# Altium schematic sheet Z7_DDR3.SchDoc
size A3
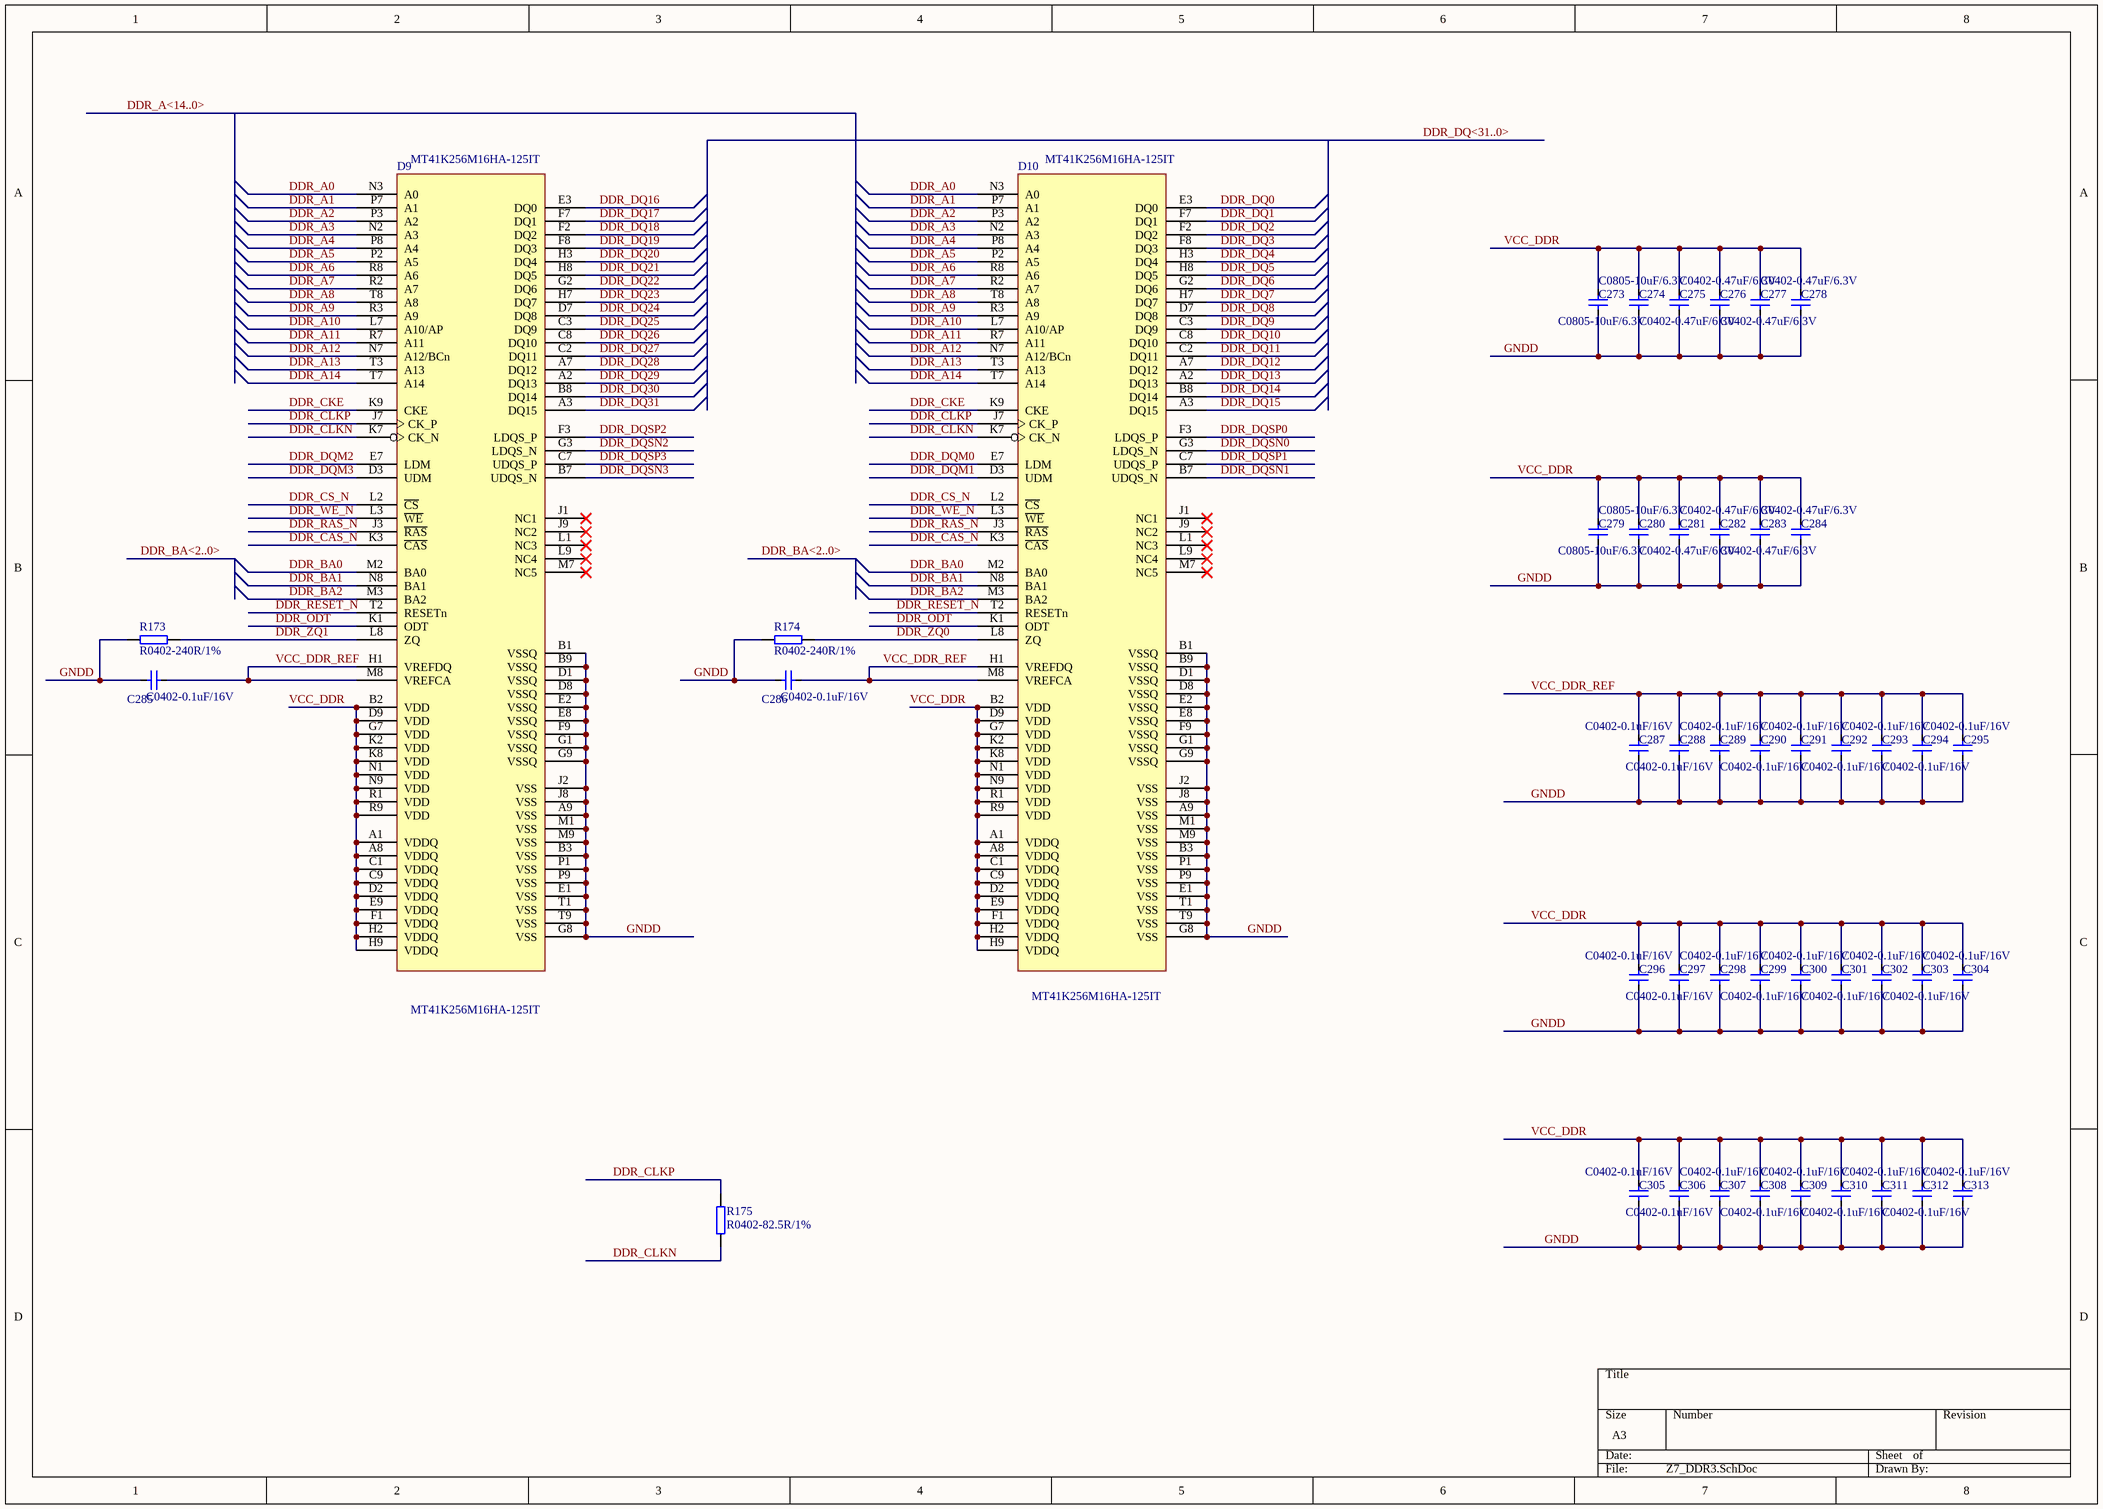
[diagram p0: Z7_DDR3.SchDoc]

## Parts
C273  C0805-10uF/6.3V  [C0805]
C274  C0805-10uF/6.3V  [C0805]
C275  C0402-0.47uF/6.3V  [C0402]
C276  C0402-0.47uF/6.3V  [C0402]
C277  C0402-0.47uF/6.3V  [C0402]
C278  C0402-0.47uF/6.3V  [C0402]
C279  C0805-10uF/6.3V  [C0805]
C280  C0805-10uF/6.3V  [C0805]
C281  C0402-0.47uF/6.3V  [C0402]
C282  C0402-0.47uF/6.3V  [C0402]
C283  C0402-0.47uF/6.3V  [C0402]
C284  C0402-0.47uF/6.3V  [C0402]
C285  C0402-0.1uF/16V  [C0402]
C286  C0402-0.1uF/16V  [C0402]
C287  C0402-0.1uF/16V  [C0402]
C288  C0402-0.1uF/16V  [C0402]
C289  C0402-0.1uF/16V  [C0402]
C290  C0402-0.1uF/16V  [C0402]
C291  C0402-0.1uF/16V  [C0402]
C292  C0402-0.1uF/16V  [C0402]
C293  C0402-0.1uF/16V  [C0402]
C294  C0402-0.1uF/16V  [C0402]
C295  C0402-0.1uF/16V  [C0402]
C296  C0402-0.1uF/16V  [C0402]
C297  C0402-0.1uF/16V  [C0402]
C298  C0402-0.1uF/16V  [C0402]
C299  C0402-0.1uF/16V  [C0402]
C300  C0402-0.1uF/16V  [C0402]
C301  C0402-0.1uF/16V  [C0402]
C302  C0402-0.1uF/16V  [C0402]
C303  C0402-0.1uF/16V  [C0402]
C304  C0402-0.1uF/16V  [C0402]
C305  C0402-0.1uF/16V  [C0402]
C306  C0402-0.1uF/16V  [C0402]
C307  C0402-0.1uF/16V  [C0402]
C308  C0402-0.1uF/16V  [C0402]
C309  C0402-0.1uF/16V  [C0402]
C310  C0402-0.1uF/16V  [C0402]
C311  C0402-0.1uF/16V  [C0402]
C312  C0402-0.1uF/16V  [C0402]
C313  C0402-0.1uF/16V  [C0402]
D9  MT41K256M16HA-125IT  [BGA96C80P16X9_1400X900X120]
D10  MT41K256M16HA-125IT  [BGA96C80P16X9_1400X900X120]
R173  R0402-240R/1%  [R0402]
R174  R0402-240R/1%  [R0402]
R175  R0402-82.5R/1%  [R0402]

## Nets
DDR_A0: D9.N3(A0) D10.N3(A0)
DDR_A1: D9.P7(A1) D10.P7(A1)
DDR_A2: D9.P3(A2) D10.P3(A2)
DDR_A3: D9.N2(A3) D10.N2(A3)
DDR_A4: D9.P8(A4) D10.P8(A4)
DDR_A5: D9.P2(A5) D10.P2(A5)
DDR_A6: D9.R8(A6) D10.R8(A6)
DDR_A7: D9.R2(A7) D10.R2(A7)
DDR_A8: D9.T8(A8) D10.T8(A8)
DDR_A9: D9.R3(A9) D10.R3(A9)
DDR_A10: D9.L7(A10/AP) D10.L7(A10/AP)
DDR_A11: D9.R7(A11) D10.R7(A11)
DDR_A12: D9.N7(A12/BCn) D10.N7(A12/BCn)
DDR_A13: D9.T3(A13) D10.T3(A13)
DDR_A14: D9.T7(A14) D10.T7(A14)
DDR_BA0: D9.M2(BA0) D10.M2(BA0)
DDR_BA1: D9.N8(BA1) D10.N8(BA1)
DDR_BA2: D9.M3(BA2) D10.M3(BA2)
DDR_CAS_N: D9.K3(~{CAS}) D10.K3(~{CAS})
DDR_CKE: D9.K9(CKE) D10.K9(CKE)
DDR_CLKN: D9.K7(CK_N) D10.K7(CK_N) R175.1
DDR_CLKP: D9.J7(CK_P) D10.J7(CK_P) R175.2
DDR_CS_N: D9.L2(~{CS}) D10.L2(~{CS})
DDR_DQ0: D10.E3(DQ0)
DDR_DQ1: D10.F7(DQ1)
DDR_DQ2: D10.F2(DQ2)
DDR_DQ3: D10.F8(DQ3)
DDR_DQ4: D10.H3(DQ4)
DDR_DQ5: D10.H8(DQ5)
DDR_DQ6: D10.G2(DQ6)
DDR_DQ7: D10.H7(DQ7)
DDR_DQ8: D10.D7(DQ8)
DDR_DQ9: D10.C3(DQ9)
DDR_DQ10: D10.C8(DQ10)
DDR_DQ11: D10.C2(DQ11)
DDR_DQ12: D10.A7(DQ12)
DDR_DQ13: D10.A2(DQ13)
DDR_DQ14: D10.B8(DQ14)
DDR_DQ15: D10.A3(DQ15)
DDR_DQ16: D9.E3(DQ0)
DDR_DQ17: D9.F7(DQ1)
DDR_DQ18: D9.F2(DQ2)
DDR_DQ19: D9.F8(DQ3)
DDR_DQ20: D9.H3(DQ4)
DDR_DQ21: D9.H8(DQ5)
DDR_DQ22: D9.G2(DQ6)
DDR_DQ23: D9.H7(DQ7)
DDR_DQ24: D9.D7(DQ8)
DDR_DQ25: D9.C3(DQ9)
DDR_DQ26: D9.C8(DQ10)
DDR_DQ27: D9.C2(DQ11)
DDR_DQ28: D9.A7(DQ12)
DDR_DQ29: D9.A2(DQ13)
DDR_DQ30: D9.B8(DQ14)
DDR_DQ31: D9.A3(DQ15)
DDR_DQM0: D10.E7(LDM)
DDR_DQM1: D10.D3(UDM)
DDR_DQM2: D9.E7(LDM)
DDR_DQM3: D9.D3(UDM)
DDR_DQSN0: D10.G3(LDQS_N)
DDR_DQSN1: D10.B7(UDQS_N)
DDR_DQSN2: D9.G3(LDQS_N)
DDR_DQSN3: D9.B7(UDQS_N)
DDR_DQSP0: D10.F3(LDQS_P)
DDR_DQSP1: D10.C7(UDQS_P)
DDR_DQSP2: D9.F3(LDQS_P)
DDR_DQSP3: D9.C7(UDQS_P)
DDR_ODT: D9.K1(ODT) D10.K1(ODT)
DDR_RAS_N: D9.J3(~{RAS}) D10.J3(~{RAS})
DDR_RESET_N: D9.T2(RESETn) D10.T2(RESETn)
DDR_WE_N: D9.L3(~{WE}) D10.L3(~{WE})
DDR_ZQ0: D10.L8(ZQ) R174.1
DDR_ZQ1: D9.L8(ZQ) R173.1
GNDD: C273.2 C274.2 C275.2 C276.2 C277.2 C278.2 C279.2 C280.2 C281.2 C282.2 C283.2 C284.2 C285.1 C286.1 C287.2 C288.2 C289.2 C290.2 C291.2 C292.2 C293.2 C294.2 C295.2 C296.2 C297.2 C298.2 C299.2 C300.2 C301.2 C302.2 C303.2 C304.2 C305.2 C306.2 C307.2 C308.2 C309.2 C310.2 C311.2 C312.2 C313.2 D9.A9(VSS) D9.B1(VSSQ) D9.B3(VSS) D9.B9(VSSQ) D9.D1(VSSQ) D9.D8(VSSQ) D9.E1(VSS) D9.E2(VSSQ) D9.E8(VSSQ) D9.F9(VSSQ) D9.G1(VSSQ) D9.G8(VSS) D9.G9(VSSQ) D9.J2(VSS) D9.J8(VSS) D9.M1(VSS) D9.M9(VSS) D9.P1(VSS) D9.P9(VSS) D9.T1(VSS) D9.T9(VSS) D10.A9(VSS) D10.B1(VSSQ) D10.B3(VSS) D10.B9(VSSQ) D10.D1(VSSQ) D10.D8(VSSQ) D10.E1(VSS) D10.E2(VSSQ) D10.E8(VSSQ) D10.F9(VSSQ) D10.G1(VSSQ) D10.G8(VSS) D10.G9(VSSQ) D10.J2(VSS) D10.J8(VSS) D10.M1(VSS) D10.M9(VSS) D10.P1(VSS) D10.P9(VSS) D10.T1(VSS) D10.T9(VSS) R173.2 R174.2
VCC_DDR: C273.1 C274.1 C275.1 C276.1 C277.1 C278.1 C279.1 C280.1 C281.1 C282.1 C283.1 C284.1 C296.1 C297.1 C298.1 C299.1 C300.1 C301.1 C302.1 C303.1 C304.1 C305.1 C306.1 C307.1 C308.1 C309.1 C310.1 C311.1 C312.1 C313.1 D9.A1(VDDQ) D9.A8(VDDQ) D9.B2(VDD) D9.C1(VDDQ) D9.C9(VDDQ) D9.D2(VDDQ) D9.D9(VDD) D9.E9(VDDQ) D9.F1(VDDQ) D9.G7(VDD) D9.H2(VDDQ) D9.H9(VDDQ) D9.K2(VDD) D9.K8(VDD) D9.N1(VDD) D9.N9(VDD) D9.R1(VDD) D9.R9(VDD) D10.A1(VDDQ) D10.A8(VDDQ) D10.B2(VDD) D10.C1(VDDQ) D10.C9(VDDQ) D10.D2(VDDQ) D10.D9(VDD) D10.E9(VDDQ) D10.F1(VDDQ) D10.G7(VDD) D10.H2(VDDQ) D10.H9(VDDQ) D10.K2(VDD) D10.K8(VDD) D10.N1(VDD) D10.N9(VDD) D10.R1(VDD) D10.R9(VDD)
VCC_DDR_REF: C285.2 C286.2 C287.1 C288.1 C289.1 C290.1 C291.1 C292.1 C293.1 C294.1 C295.1 D9.H1(VREFDQ) D9.M8(VREFCA) D10.H1(VREFDQ) D10.M8(VREFCA)

Not connected (* = marked no-connect by the designer): D9 J1(NC1)* J9(NC2)* L1(NC3)* L9(NC4)* M7(NC5)*; D10 J1(NC1)* J9(NC2)* L1(NC3)* L9(NC4)* M7(NC5)*

## Buses and harness runs
bus DDR_A<14..0>
bus DDR_BA<2..0>
bus DDR_DQ<31..0>

## Library data of the parts
C273 C274 C279 C280 = C1210-22uF/16V: Part_number: C0805-10uF/6.3V; Part_type: CAP; Value: C0805-10uF/6.3V; Schematic_Part: CAP; PCB_Footprint: C0805
C275-C278 C281-C313 = C0402-0.1uF/16V: X7R; Manufacturer: SAMSUNG; Manufacturer_p/n: CL05X7R104KO5NNN; Part_type: CAP; temperature: -55℃\+125℃; Schematic_Part: CAP; PCB_Footprint: C0402; datasheet: #DataSheet\C_Samsung_General Capacitors.pdf#
  C275-C278 C281-C284: Part_number: C0402-0.47uF/6.3V; Value: C0402-0.47uF/6.3V
  C285-C313: Part_number: C0402-0.1uF/16V; Value: C0402-0.1uF/16V
D9 D10 = MT41K256M16: Part_number: MT41K256M16HA-125IT
R173-R175 = R0402-10K: Manufacturer: SAMSUNG; Part_type: RES; Schematic_Part: RES; PCB_Footprint: R0402
  R173 R174: Part_number: R0402-240R/1%; Value: R0402-240R/1%
  R175: Part_number: R0402-82.5R/1%; Value: R0402-82.5R/1%